# EasyEDA Pro project ProPrj_SCH_1.69寸触摸屏驱动板v2_2024-10-31_2024-11-01.epro

# Schematic 1.69寸触摸屏驱动板v2
Board Name: 1.69寸触摸屏驱动板v2; Create Date: 2024-10-31; Page Name: Sheet_1; Project Name: SCH_1.69寸触摸屏驱动板v2_2024-10-31; Schematic Name: 1.69寸触摸屏驱动板v2; Update Date: 2024-10-31; Add into BOM: yes; Company: Your Company; Convert to PCB: yes; Date: 2022-06-14; Draw By: raspberrx; REV: 1.0; Sheet: 1/1
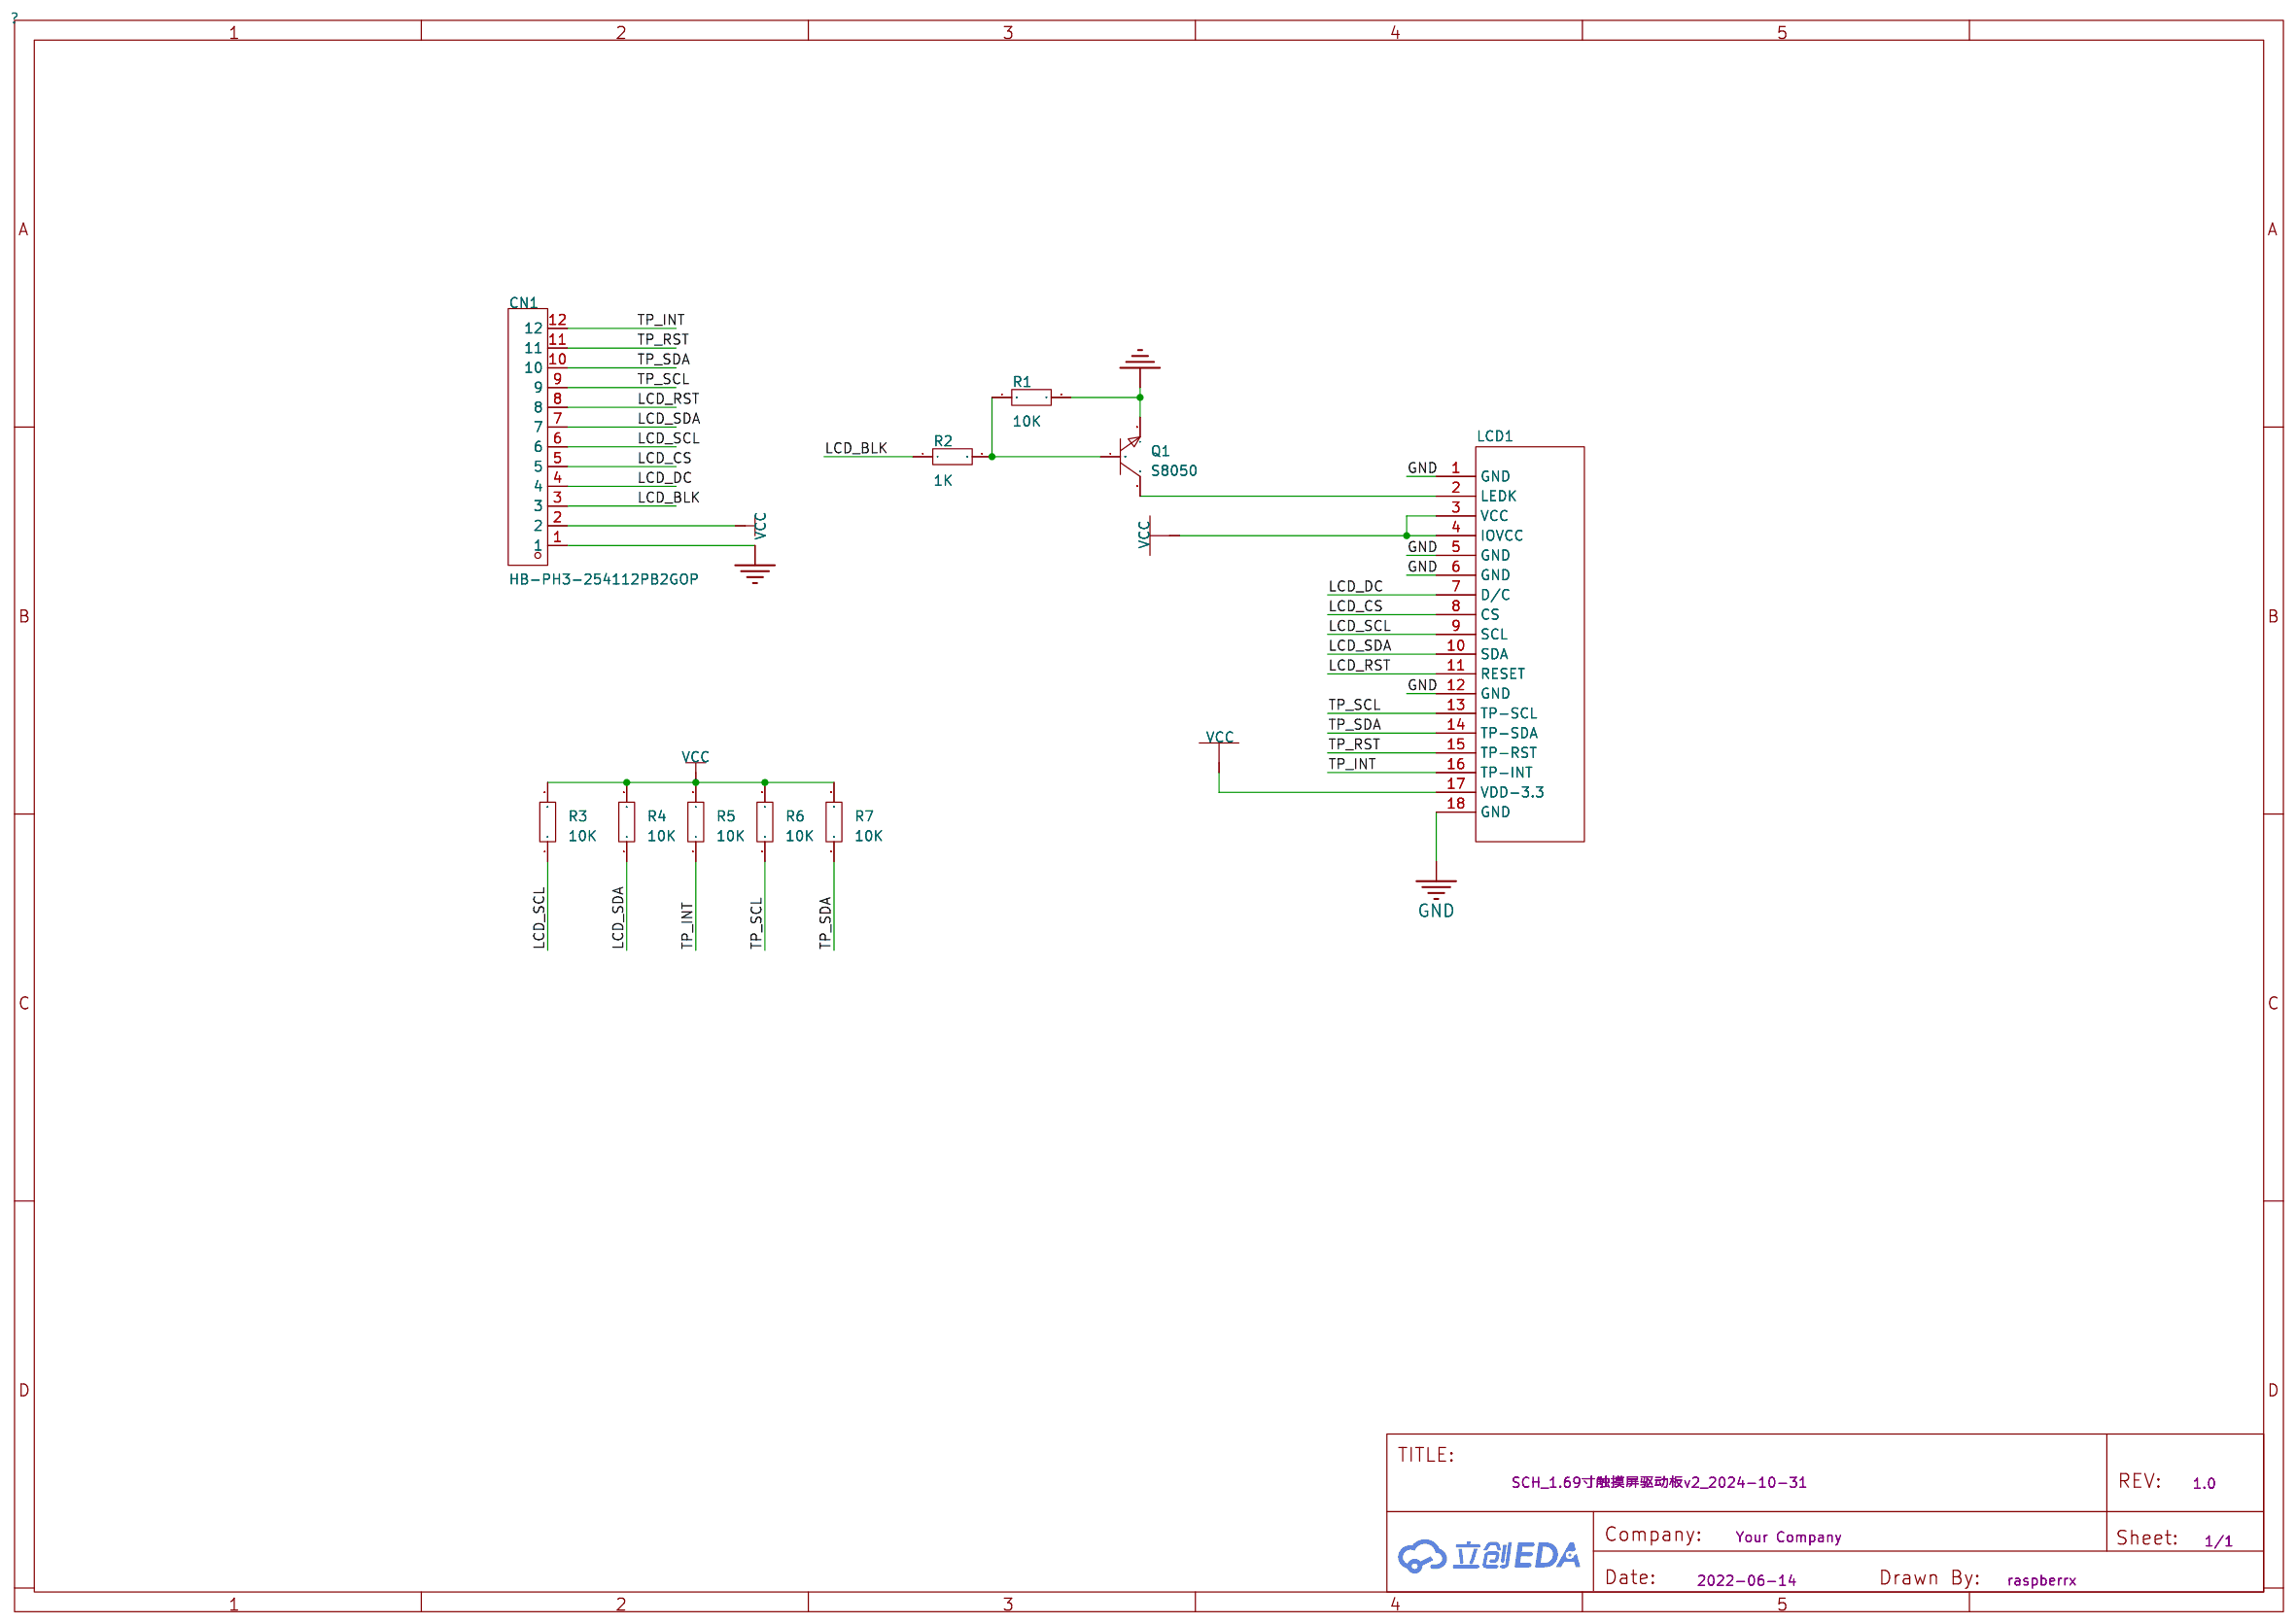
[diagram p0: schematic sheet]

## Parts
CN1  HB-PH3-254112PB2GOP  [HDR-TH_12P-P2.54-V-M]
LCD1  -  [FPC-SMD_18P-P0.50_HDGC_0.5K-HX-18PWB]
Q1  S8050  [SOT-23-3_L2.9-W1.3-P1.90-LS2.3-BR]
R1  10K  [R0603]
R2  1K  [R0603]
R3  10K  [R0603]
R4  10K  [R0603]
R5  10K  [R0603]
R6  10K  [R0603]
R7  10K  [R0603]

## Library data of the parts
CN1 = HB-PH3-254112PB2GOP: 插针结构:1x12P;间距:2.54mm;行距:2.54mm;圆针/方针:方针;安装类型:直插;排数:单排;总PIN位数:12P;额定电流:3A;额定电压:250V;配合针长度:6mm;塑高:2.54mm;端接针长度:3mm;触头材质:黄铜;触头镀层:金;工作温度范围:-40℃~+105℃;焊接温度(最大值):260℃;颜色:黑色;; LCSC Part Name: 间距:2.54mm 1x12P 直插 方针; Supplier Part: C6332195; Manufacturer: HANBO(汉博); Supplier Footprint: 插件,P=2.54mm; JLCPCB Part Class: 扩展库; Datasheet: https://atta.szlcsc.com/upload/public/pdf/source/20230803/F72D259687963761DF1B552F3BB84A31.pdf; Supplier: LCSC; Pin Structure: 1x12P; Pitch: 2.54mm; Row Spacing: 2.54mm; Circluar Pins/Square Pins: 方针; Mounting Type: 直插; Number of Rows: 单排; Number of Pins: 12P; Current Rating (Max): 3A; Voltage Rating (Max): 250V; Length of Mating Pin: 6mm; Insulation Height: 2.54mm; Length of End Connection Pin: 3mm; Contact Material: 黄铜; Contact Plating: 金; Operating Temperature Range: -40℃~+105℃; Soldering Temperature(Max): 260℃; Color: 黑色
LCD1 = 1.69寸屏幕: https://item.taobao.com/item.htm?spm=a1z0d.6639537.1997196601.49.7a0174846ueIFD&id=662619384744
Q1 = S8050_C20069125: 晶体管类型:NPN;集电极电流(Ic):500mA;集射极击穿电压(Vceo):25V;功率(Pd):300mW;直流电流增益(hFE@Ic,Vce):120@50mA,1.0V;; LCSC Part Name: NPN 电流:500mA 耐压:25V; Supplier Part: C20069125; Manufacturer: 宏迦橙; Supplier Footprint: SOT-23; JLCPCB Part Class: 扩展库; Datasheet: https://atta.szlcsc.com/upload/public/pdf/source/20240403/2D78449C96B6E27F13BF8BDF79E27159.pdf; Supplier: LCSC; Transistor Type: NPN; Collector Current (Ic): 500mA; Collector-Emitter Breakdown Voltage (Vceo): 25V; Power Dissipation (Pd): 300mW; DC Current Gain (hFE@Ic,Vce): 120@50mA,1.0V; Transition Frequency (fT): 100MHz; Collector Cut-Off Current (Icbo): 100nA; Collector-Emitter Saturation Voltage (VCE(sat)@Ic,Ib): 600mV@500mA,50mA; Operating Temperature: -55℃~+150℃
R1-R7 = Res_0603: Supplier Footprint: 0603

## Nets
GND: CN1.1 LCD1.1(GND) LCD1.5(GND) LCD1.6(GND) LCD1.12(GND) LCD1.18(GND) Q1.2(E) R1.2
VCC: CN1.2 LCD1.3(VCC) LCD1.4(IOVCC) LCD1.17(VDD-3.3) R3.2 R4.2 R5.2 R6.2 R7.2
LCD_BLK: CN1.3 R2.1
LCD_CS: CN1.5 LCD1.8(CS)
LCD_DC: CN1.4 LCD1.7(D/C)
LCD_RST: CN1.8 LCD1.11(RESET)
LCD_SCL: CN1.6 LCD1.9(SCL) R3.1
LCD_SDA: CN1.7 LCD1.10(SDA) R4.1
TP_INT: CN1.12 LCD1.16(TP-INT) R5.1
TP_RST: CN1.11 LCD1.15(TP-RST)
TP_SCL: CN1.9 LCD1.13(TP-SCL) R6.1
TP_SDA: CN1.10 LCD1.14(TP-SDA) R7.1
$1N1119: LCD1.2(LEDK) Q1.3(C)
$1N1175: Q1.1(B) R1.1 R2.2

# Board PCB1
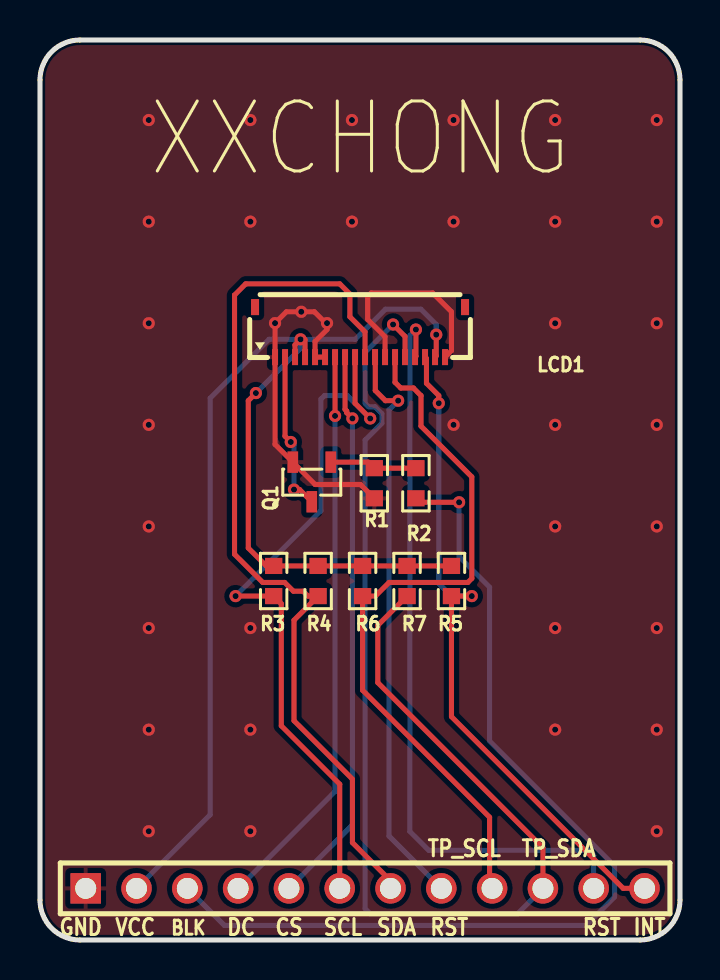
[diagram p1: board, top side]
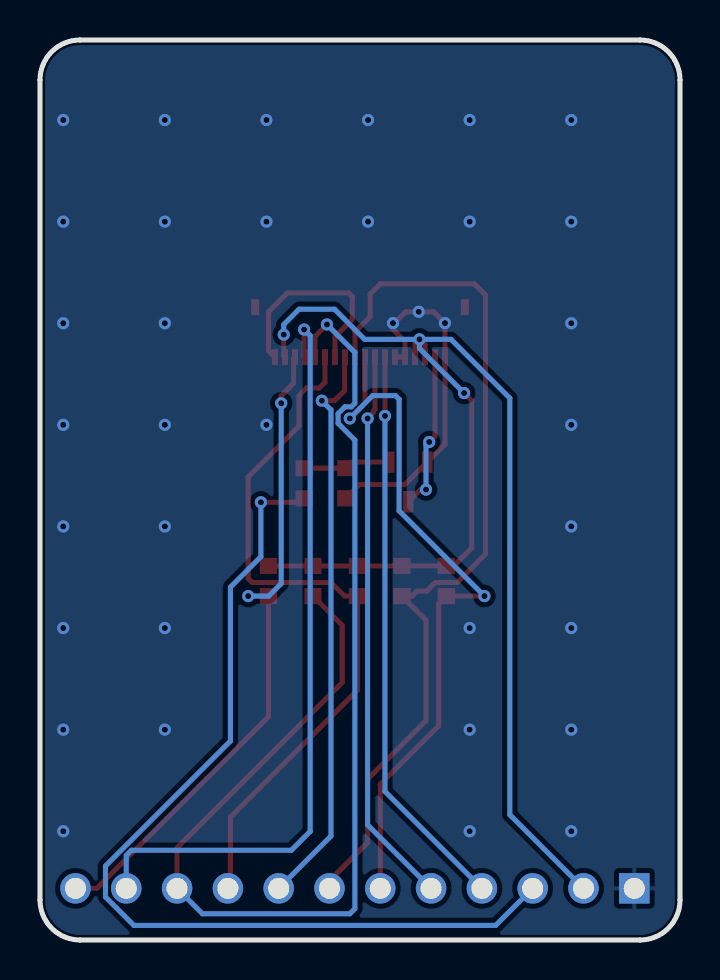
[diagram p2: board, bottom side, seen from below]

Outline 32 x 45 mm; copper layers: Top Layer, Bottom Layer. Coordinates in mm from the lower left corner of the outline.
Outline path: 0,43 0,2 arc(0.59,0.59) 2,0 30,0 arc(31.41,0.59) 32,2 32,43 arc(31.41,44.41) 30,45 2,45 arc(0.59,44.41) 0,43
Stack: Top Layer 0.035mm / Dielectric1 1.51mm FR4 er 4.5 / Bottom Layer 0.035mm

## Design rules (mm)
template: JLCPCB Capability(Two Layers Board)
spacing copperThickness1oz (default): track to track 0.102, other pairs 0.152 to 0.3
spacing copperThickness2oz: track to track 0.203, other pairs 0.152 to 0.3
track width copperThickness1oz (default): min 0.127, default 0.254, max 2.54
track width copperThickness2oz: min 0.203, default 0.254, max 2.54
differential pair differentialPair (default): width min 0.127, default 0.254, max 2.54; gap min 0.152, default 0.152
via viaSize (default): diameter min 0.5, default 0.61, max 10; hole min 0.3, default 0.305, max 6.3

## Placement (name value [footprint] x y rotation side)
CN1  HB-PH3-254112PB2GOP  [HDR-TH_12P-P2.54-V-M]  16.26 2.58 0 top
LCD1  -  [FPC-SMD_18P-P0.50_HDGC_0.5K-HX-18PWB]  16 30.4 180 top
Q1  S8050  [SOT-23-3_L2.9-W1.3-P1.90-LS2.3-BR]  13.59 22.9 90 top
R1  10K  [R0603]  16.71 22.84 270 top
R2  1K  [R0603]  18.8 22.84 90 top
R3  10K  [R0603]  11.68 17.95 90 top
R4  10K  [R0603]  13.91 17.95 90 top
R5  10K  [R0603]  20.57 17.95 90 top
R6  10K  [R0603]  16.13 17.95 90 top
R7  10K  [R0603]  18.35 17.95 90 top

## Footprints (pads in the part's own frame, mm; a bottom-side part is the same pattern mirrored in y, then rotated)
FPC-SMD_18P-P0.50_HDGC_0.5K-HX-18PWB
  rect 0.3x0.8 smd: 1(4.25,1.25) 2(3.75,1.25) 3(3.25,1.25) 4(2.75,1.25) 5(2.25,1.25) 6(1.75,1.25) 7(1.25,1.25) 8(0.75,1.25) 9(0.25,1.25) 10(-0.25,1.25) 11(-0.75,1.25) 12(-1.25,1.25) 13(-1.75,1.25) 14(-2.25,1.25) 15(-2.75,1.25) 16(-3.25,1.25) 17(-3.75,1.25) 18(-4.25,1.25)
  rect 0.4x0.8 smd: 19(-5.25,-1.25) 20(5.25,-1.25)
HDR-TH_12P-P2.54-V-M
  rect 1.524x1.524 hole 1.05: 1(-13.97,0)
  round 1.524 hole 1.05: 2(-11.43,0) 3(-8.89,0) 4(-6.35,0) 5(-3.81,0) 6(-1.27,0) 7(1.27,0) 8(3.81,0) 9(6.35,0) 10(8.89,0) 11(11.43,0) 12(13.97,0)
R0603
  rect 0.806x0.864 smd: 1(-0.753,0) 2(0.753,0)
SOT-23-3_L2.9-W1.3-P1.90-LS2.3-BR
  rect 1.07x0.532 smd: 1(0.99,-0.95) 2(0.99,0.95) 3(-0.99,0)

## Nets
As in the schematic.

Pads without a net: LCD1 19 20

## Via types
v1: diameter 0.61, hole 0.305, Top Layer to Bottom Layer, 51 vias

## Routing (per net, layer and track width the routed paths; a pad name or vN(x,y) marks a point on that pad's centre or on a via; arc(x,y) is an arc through that point)
GND: length 28.1
  Top Layer w0.254: R1.2 16.02,22.78 13.76,22.78 12.64,23.89 11.75,24.78 LCD1.1 v1(11.75,30.84) 12.32,31.41 v1(13.06,31.41) 13.72,31.41 14.35,30.78 14.35,30.52 13.75,29.92 LCD1.5 LCD1.6 ; LCD1.18 20.57,29.47 20.57,31.41 19.63,32.35 16.56,32.35 16.38,32.17 16.38,31.03 17.25,30.16 LCD1.12
  vias: v1(5.44,41) v1(5.44,35.92) v1(5.44,30.84) v1(5.44,25.76) v1(5.44,20.68) v1(5.44,15.6) v1(5.44,10.52) v1(5.44,5.44) v1(10.52,41) v1(10.52,35.92) v1(10.52,15.6) v1(10.52,10.52) v1(10.52,5.44) v1(14.35,30.84) v1(15.6,41) v1(15.6,35.92) v1(20.68,41) v1(20.68,35.92) v1(20.68,25.76) v1(25.76,41) v1(25.76,35.92) v1(25.76,30.84) v1(25.76,25.76) v1(25.76,20.68) v1(25.76,15.6) v1(25.76,10.52) v1(30.84,41) v1(30.84,35.92) v1(30.84,30.84) v1(30.84,25.76) v1(30.84,20.68) v1(30.84,15.6) v1(30.84,10.52) v1(30.84,5.44)
VCC: length 65.3
  Top Layer w0.254: LCD1.17 19.81,29.21 v1(19.81,30.27) ; R5.2 R7.2 R6.2 R4.2 11.31,18.7 10.41,19.6 10.41,26.97 v1(10.79,27.35) ; LCD1.3 12.75,29.76 v1(13.03,30.03) 13.23,30.03 13.25,30.01 LCD1.4
  Bottom Layer w0.254: v1(13.03,30.03) 11.45,30.03 8.51,27.09 8.51,6.27 CN1.2 ; v1(13.03,30.03) 15.77,30.03 17.27,31.54 19.05,31.54 19.81,30.78 v1(19.81,30.27) ; v1(13.03,30.03) 13.03,29.58 v1(10.79,27.35)
LCD_BLK: length 47.9
  Top Layer w0.254: R2.1 18.99,21.89 v1(20.95,21.89)
  Bottom Layer w0.254: CN1.3 9.22,0.73 27.3,0.73 28.73,2.15 28.73,3.7 22.48,9.95 22.48,17.64 20.95,19.16 v1(20.95,21.89)
LCD_CS: length 28
  Top Layer w0.254: LCD1.8 15.25,26.53 15.34,26.45 15.34,26.36 v1(15.62,26.08)
  Bottom Layer w0.254: v1(15.62,26.08) 15.62,5.76 CN1.5
LCD_DC: length 28.6
  Top Layer w0.254: LCD1.7 v1(14.75,26.2)
  Bottom Layer w0.254: v1(14.75,26.2) 14.75,7.43 CN1.4
LCD_RST: length 28.7
  Top Layer w0.254: v1(17.91,26.97) 17.27,26.97 16.76,27.47 16.76,29.13 LCD1.11
  Bottom Layer w0.254: v1(17.91,26.97) 17.45,26.51 17.45,5.2 CN1.8
LCD_SCL: length 35.9
  Top Layer w0.254: LCD1.9 15.75,26.84 v1(16.51,26.08) ; v1(9.78,17.2) R3.1 12.06,16.81 12.06,10.71 14.99,7.79 CN1.6
  Bottom Layer w0.254: v1(16.51,26.08) 15.37,27.22 14.22,27.22 14.04,27.04 14.04,21.46 v1(9.78,17.2)
LCD_SDA: length 44.8
  Top Layer w0.254: LCD1.10 16.25,30.4 15.49,31.16 15.49,32.3 14.99,32.81 10.29,32.81 9.73,32.25 9.73,19.29 11.14,17.88 12.23,17.88 12.67,17.44 13.15,17.44 13.4,17.2 R4.1 12.7,15.99 12.7,10.96 15.62,8.04 15.62,4.87 17.53,2.96 CN1.7
TP_INT: length 33.8
  Top Layer w0.254: v1(19.94,26.84) 19.94,27.22 19.32,27.84 19.32,29.07 LCD1.16 ; v1(21.59,17.2) R5.1 20.57,11.17 29.16,2.58 CN1.12
  Bottom Layer w0.254: v1(19.94,26.84) 19.94,17.82 20.57,17.2 v1(21.59,17.2)
TP_RST: length 38
  Top Layer w0.254: v1(18.8,30.52) 18.8,29.19 LCD1.15
  Bottom Layer w0.254: CN1.11 27.69,4.23 27.43,4.49 19.43,4.49 18.49,5.43 18.49,30.22 v1(18.8,30.52)
TP_SCL: length 36.2
  Top Layer w0.254: CN1.9 22.48,2.71 22.48,6.14 16.13,12.49 R6.1 16.77,17.2 17.45,17.88 21.39,17.88 21.59,18.08 21.59,23.16 19.05,25.7 19.05,27.22 18.67,27.6 18.03,27.6 17.75,27.88 LCD1.13
TP_SDA: length 60.7
  Top Layer w0.254: v1(17.65,30.78) 18.25,30.18 LCD1.14 ; R7.1 16.89,15.74 16.89,12.87 25.15,4.61 CN1.10
  Bottom Layer w0.254: v1(17.65,30.78) 16.26,29.38 16.26,26.83 16.43,26.66 16.75,26.66 17.09,26.32 17.09,25.84 16.26,25 16.26,1.57 16.51,1.31 23.88,1.31 CN1.10
$1N1119: length 8
  Top Layer w0.254: v1(12.54,24.9) 12.25,25.19 LCD1.2 ; v1(12.7,22.52) 12.98,22.52 Q1.3
  Bottom Layer w0.254: v1(12.54,24.9) 12.7,24.74 v1(12.7,22.52)
$1N1175: length 4.4
  Top Layer w0.254: R2.2 R1.1 16.41,23.89 Q1.1

## Copper pours and planes (outline as drawn; the poured copper is in the pictures)
GND on Top Layer: -0.25,45.76 32.51,45.76 32.51,0.17 -0.25,0.17
GND on Bottom Layer: -0.76,46.14 32.89,46.14 32.89,-1.48 -0.76,-1.48

## Text on the board
Top Silkscreen Layer: BLK | GND | VCC | DC | CS | SCL | SDA | TP_SCL | RST | TP_SDA | INT | XXCHONG
